# Altium project MotoBot.PrjPCB
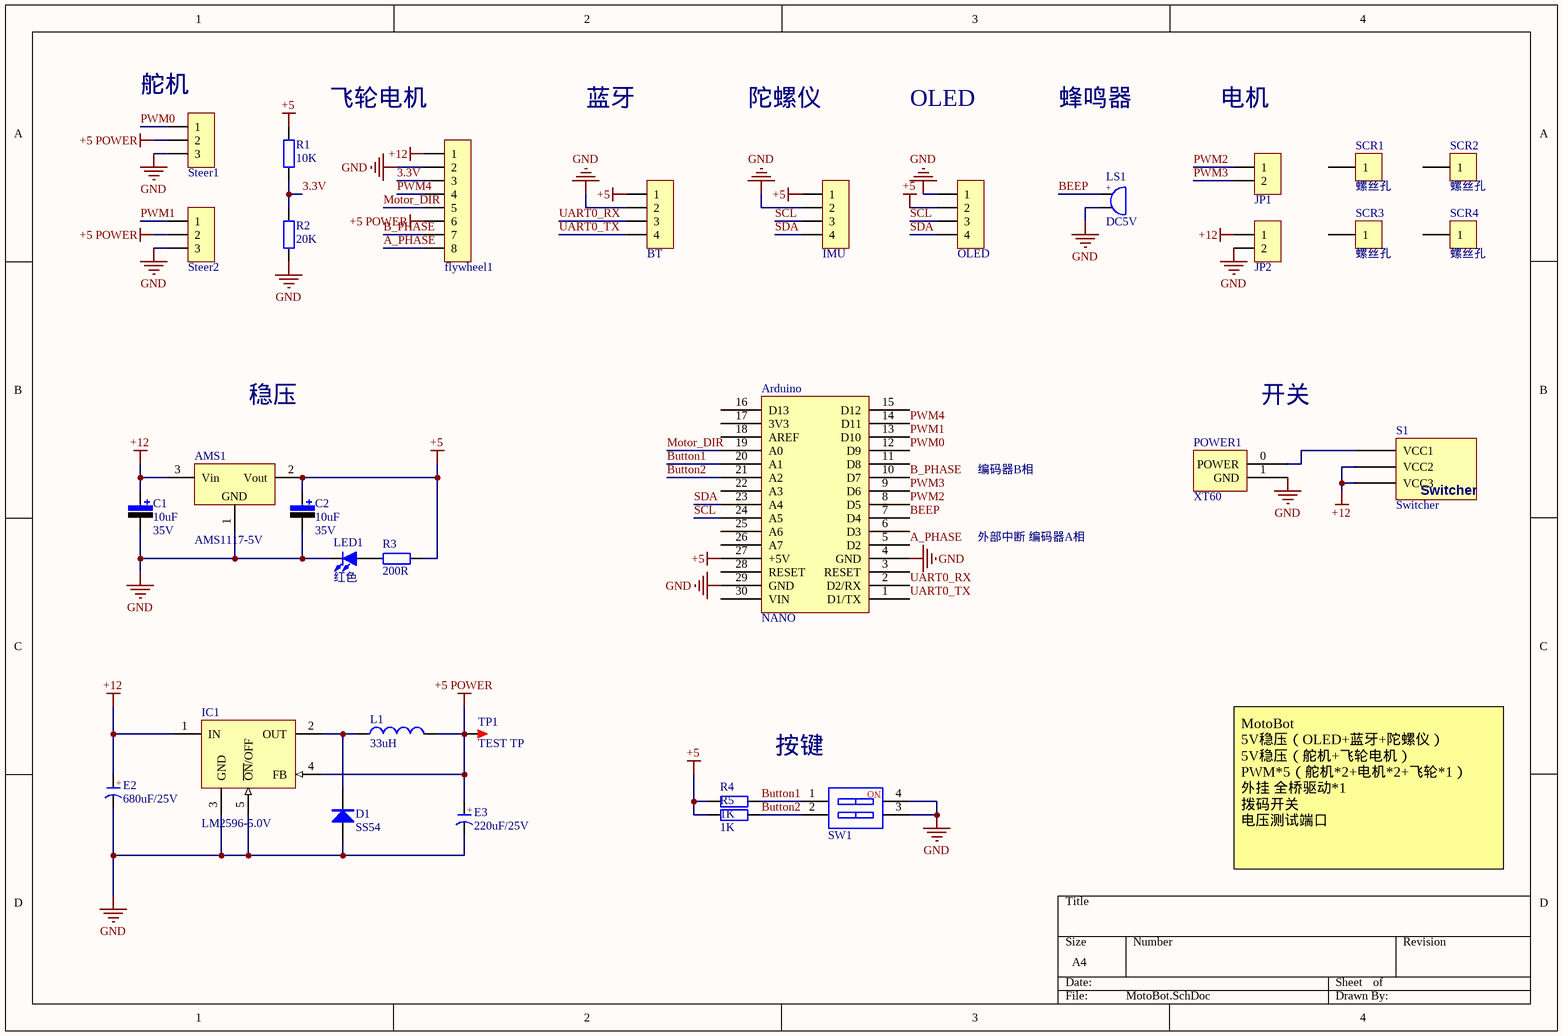
[diagram p0: MotoBot.SchDoc]
1 sheet, 32 parts. Net scope: global (net labels, ports and power ports of the same name join across sheets).
Board file: MotoBot.PcbDoc

## Sheet MotoBot.SchDoc
size A4

### Parts
AMS1  AMS1117-5V  [SOT-223]
Arduino  NANO  [NANO]
BT  HDR-1X4  [HDR-1X4_M]  (value not drawn)
C1  value 10uF  Vol: 35V  [CAP-7343]  (hidden comment: Cap Pol)
C2  value 10uF  Vol: 35V  [CAP-7343]  (hidden comment: Cap Pol)
D1  SS54  [SMA]
E2  680uF/25V  [CAP 3.5*8*11.5]
E3  220uF/25V  [CAP 2.0*5*11]
flywheel1  HDR-1X8  [ZH1.5-WI-8P]  (value not drawn)
IC1  LM2596-5.0V  [TO263-5A]
IMU  HDR-1X4  [HDR-1X4_M]  (value not drawn)
JP1  HDR-1X2  [KF128-5.08-2P]  (value not drawn)
JP2  HDR-1X2  [KF128-5.08-2P]  (value not drawn)
L1  33uH  [CDRH74]
LED1  红色  [LED 0805W]
LS1  DC5V  [BEEP 5x9x5.5]
OLED  HDR-1X4  [HDR-1X4_M]  (value not drawn)
POWER1  XT60  [XT60]
R1  10K  [R 0805_L]
R2  20K  [R 0805_L]
R3  200R  [R 0805_L]
R4  1K  [R 0805_L]
R5  1K  [R 0805_L]
S1  Switcher  [ThreeSwitcher]
SCR1  螺丝孔  [LQ_SCROW3&5mm]
SCR2  螺丝孔  [LQ_SCROW3&5mm]
SCR3  螺丝孔  [LQ_SCROW3&5mm]
SCR4  螺丝孔  [LQ_SCROW3&5mm]
Steer1  HDR-1X3  [HDR-1X3]  (value not drawn)
Steer2  HDR-1X3  [HDR-1X3]  (value not drawn)
SW1  CSW-2P  [CSW DIP-2P]  (value not drawn)
TP1  TEST TP  [TEST TP1.4_B]

### Nets
+5: AMS1.2(Vout) Arduino.27(+5V) BT.1 C2.1 IMU.1 OLED.2 R1.1 R3.2 R4.1 R5.1
+5 POWER: E3.1(A) flywheel1.6 IC1.4(FB) L1.2 Steer1.2 Steer2.2 TP1.1
+12: AMS1.3(Vin) C1.1 E2.1(A) flywheel1.1 IC1.1(IN) JP2.1 S1.VCC2 S1.VCC3
GND: AMS1.1(GND) Arduino.4(GND) Arduino.29(GND) BT.2 C1.2 C2.2 D1.1(A) E2.2(K) E3.2(K) flywheel1.2 IC1.3(GND) IC1.5(~{ON}/OFF) IMU.2 JP2.2 LED1.2(K) LS1.2 OLED.1 POWER1.1(GND) R2.2 Steer1.3 Steer2.3 SW1.3 SW1.4
3.3V: flywheel1.3 R1.2 R2.1
A_PHASE: Arduino.5(D2) flywheel1.8
B_PHASE: Arduino.10(D7) flywheel1.7
BEEP: Arduino.7(D4) LS1.1
Button1: Arduino.20(A1) R4.2 SW1.1
Button2: Arduino.21(A2) R5.2 SW1.2
Motor_DIR: Arduino.19(A0) flywheel1.5
PWM0: Arduino.12(D9) Steer1.1
PWM1: Arduino.13(D10) Steer2.1
PWM2: Arduino.8(D5) JP1.1
PWM3: Arduino.9(D6) JP1.2
PWM4: Arduino.14(D11) flywheel1.4
SCL: Arduino.24(A5) IMU.3 OLED.3
SDA: Arduino.23(A4) IMU.4 OLED.4
UART0_RX: Arduino.2(D2/RX) BT.3
UART0_TX: Arduino.1(D1/TX) BT.4
NetD1_2: D1.2(K) IC1.2(OUT) L1.1
NetLED1_1: LED1.1(A) R3.1
NetPOWER1_0: POWER1.0(POWER) S1.VCC1

Not connected (* = marked no-connect by the designer): Arduino 3(RESET) 6(D3) 11(D8) 15(D12) 16(D13) 17(3V3) 18(AREF) 22(A3) 25(A6) 26(A7) 28(RESET) 30(VIN); SCR1 1; SCR2 1; SCR3 1; SCR4 1

### Notes on the sheet
- (near Steer1) 舵机
- (near R1) 飞轮电机
- 蓝牙
- 陀螺仪
- OLED
- 蜂鸣器
- 电机
- 稳压
- 开关
- 编码器B相
- 外部中断 编码器A相
- 按键
- MotoBot
  5V稳压（OLED+蓝牙+陀螺仪）
  5V稳压（舵机+飞轮电机）
  PWM*5（舵机*2+电机*2+飞轮*1）
  外挂 全桥驱动*1
  拨码开关
  电压测试端口
- (in symbol BEEP) +
- (in symbol C-CAP) +
- (in symbol CSW-2P) NO

### Library data of the parts
AMS1 = AMS1117: 三端稳压芯片; BOM名称: 稳压芯片; 版权归属: 黎明电子style; 学习资源: https://lmdzstyle.taobao.com/
BT IMU OLED = Header 4: 4P接插件; 版权归属: 黎明电子style; BOM名称: 4P接插件; 学习资源: https://lmdzstyle.taobao.com/
C1 C2 = Cap Pol: 极性电解电容; Published: 8-Jun-2000; LatestRevisionDate: 17-Jul-2002; LatestRevisionNote: Re-released for DXP Platform.; PackageReference: RB7.6-15; Publisher: Altium Limited
D1 = SS14: 肖特基二极管; 版权归属: 源创客; 属性: 40V/1A; BOM名称: 肖特基二极管; 学习资源: www.ooocke.com
E2 E3 = C-CAP: 直插电解电容; 版权归属: 源创客; BOM名称: 直插电解电容; 学习资源: www.ooocke.com
flywheel1 = Header 8: 8P接插件; 版权归属: 源创客; BOM名称: 8P接插件; 学习资源: www.ooocke.com
IC1 = LM2596-5.0: DC降压芯片; BOM名称: DC稳压芯片; 版权归属: 源创客; 学习资源: www.ooocke.com
JP1 JP2 = Header 2: 2P接插件; 版权归属: 源创客; BOM名称: 2P接插件; 学习资源: www.ooocke.com
L1 = Inductor
LED1 = LED-SMD: 贴片LED; 版权归属: 源创客; BOM名称: 贴片LED; 学习资源: www.ooocke.com
LS1 = BEEP: 蜂鸣器; 版权归属: 源创客; BOM名称: 蜂鸣器; 学习资源: www.ooocke.com
R1-R5 = R: 贴片电阻; 版权归属: 源创客; BOM名称: 贴片电阻; 学习资源: www.ooocke.com
S1 = 3_Switcher: pin to pad: VCC1>1 VCC2>2 VCC3>3
SCR1-SCR4 = CON1: Connector
Steer1 Steer2 = Header 3: 3P接插件; 版权归属: 黎明电子style; BOM名称: 3P接插件; 学习资源: https://lmdzstyle.taobao.com/
SW1 = CSW-2P: 2路编码开关; 版权归属: 源创客; BOM名称: 2路编码开关; 学习资源: www.ooocke.com
TP1 = TEST TP: 测试环; 版权归属: 源创客; BOM名称: 测试环; 学习资源: www.ooocke.com